# EAGLE schematic SelfTestWiring (EAGLE 7.6.0)
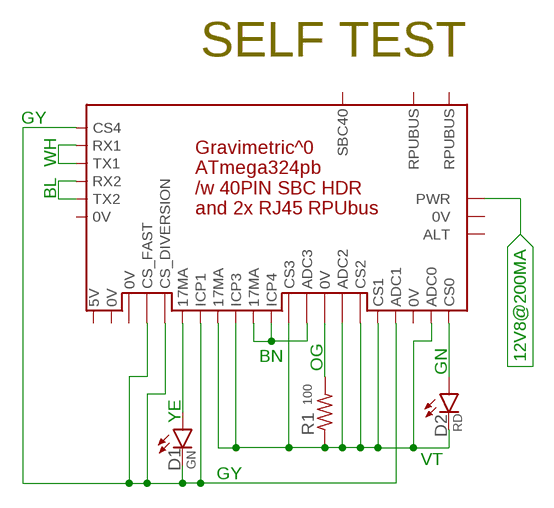
[diagram p0: schematic, sheet 1]

## Parts
D1  GN  LED5MM  [LED5MM]
D2  RD  LED5MM  [LED5MM]
R1  100  R0805  [C0805(2012)]
U$1  GRAVIMETRIC  [WITH_RPU_NAMES]

## Nets
12V8@200MA: U$1.PWR
BL: U$1.K2(RX2) U$1.K4(TX2)
BN: U$1.17MA@ICP4(17MA) U$1.ADC3 U$1.ICP4
GN: D2.A U$1.22MA@ADC1(CS0)
GY: D1.K U$1.22MA@ADC4(CS4) U$1.22MA@DIO2(CS_DIVERSION) U$1.22MA@DIO9(CS_FAST) U$1.ADC0(ADC1) U$1.ICP1
OG: R1.2 U$1.0V@ADC2(0V)
VT: D2.K R1.1 U$1.17MA@ICP3(17MA) U$1.22MA@ADC0(CS1) U$1.22MA@ADC2(CS2) U$1.22MA@ADC3(CS3) U$1.ADC1(ADC0) U$1.ADC2 U$1.ICP3
WH: U$1.K1(RX1) U$1.K3(TX1)
YE: D1.A U$1.17MA@ICP1(17MA)
Unconnected: U$1.0V U$1.0V@ADC1(0V) U$1.0V@DIO2(0V) U$1.0V@DIO9(0V) U$1.0V@PWR(0V) U$1.5V U$1.+RX(RPUBUS) U$1.+TX(RPUBUS) U$1.BAT(ALT) U$1.SPI(SBC40)

## Notes on the sheet
- SELF TEST

## Library data of the parts
D1 D2 = D-LED:LED: LED 120120WH [CREE,XHGAWT-00-0000-00000HXE1] LED WHITE 6500K 150LUM-W120120
R1 = R-C:R: Resiistor American-style symbol
U$1 = Documentation:GRAVIMETRIC: Gravimetric /w ATmega324pb